# EAGLE schematic Lattepanda_shild_v1.3 (EAGLE 6.5.0)
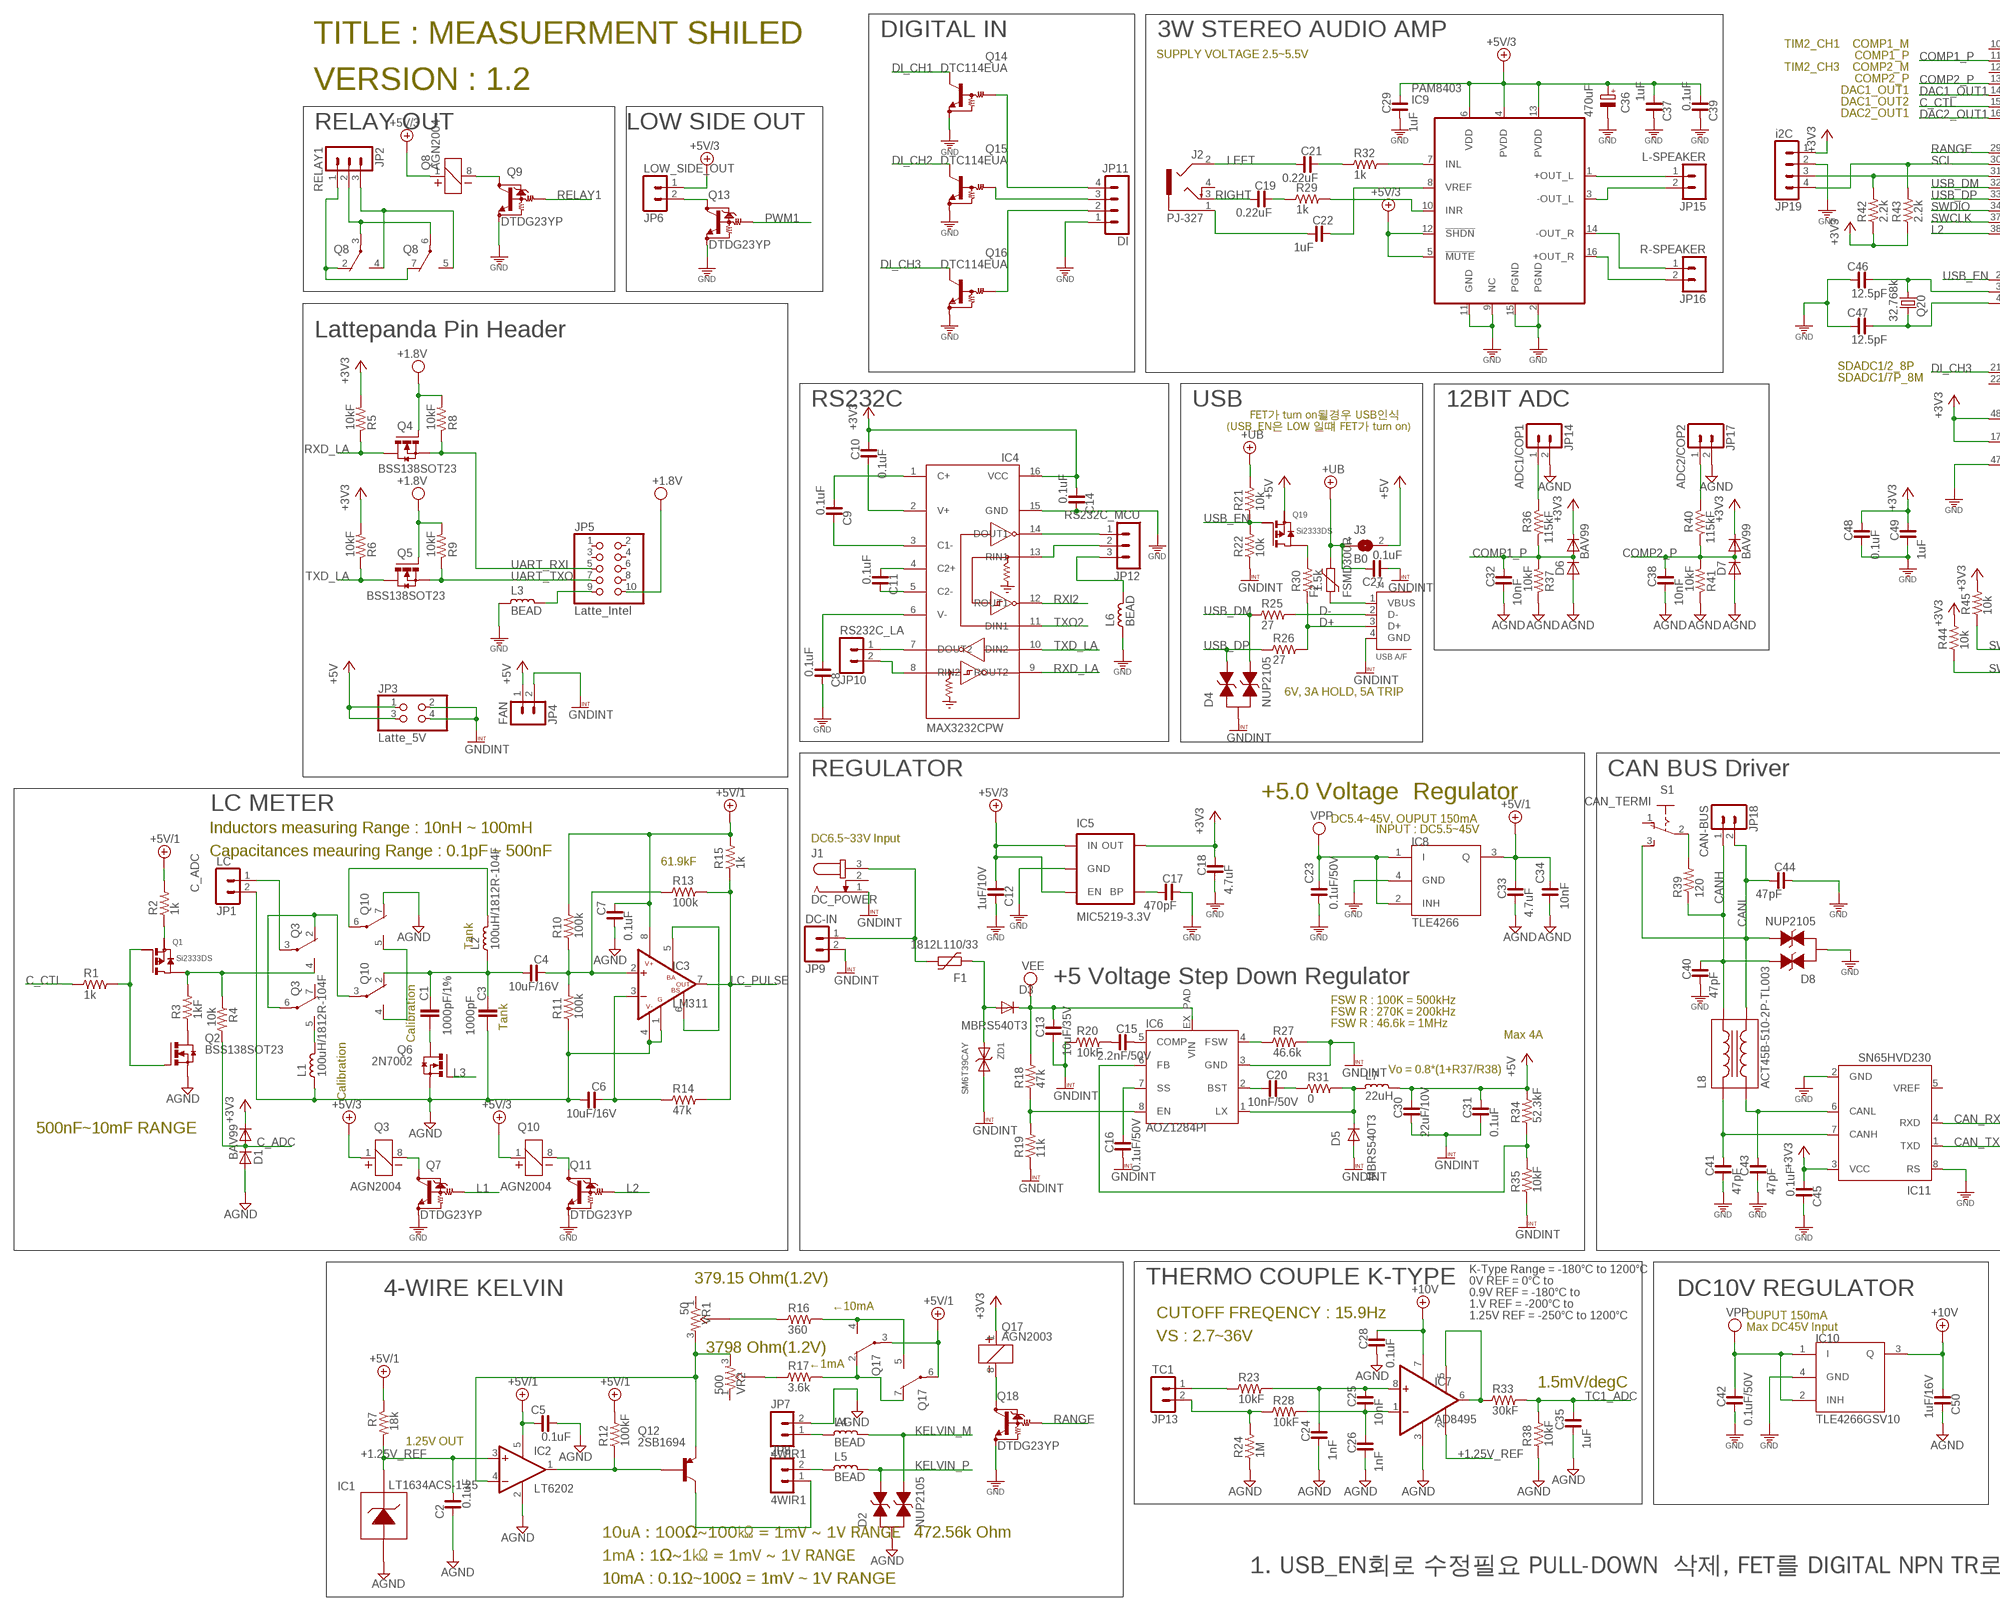
[diagram p0: schematic, sheet 1, part 1 of 2]
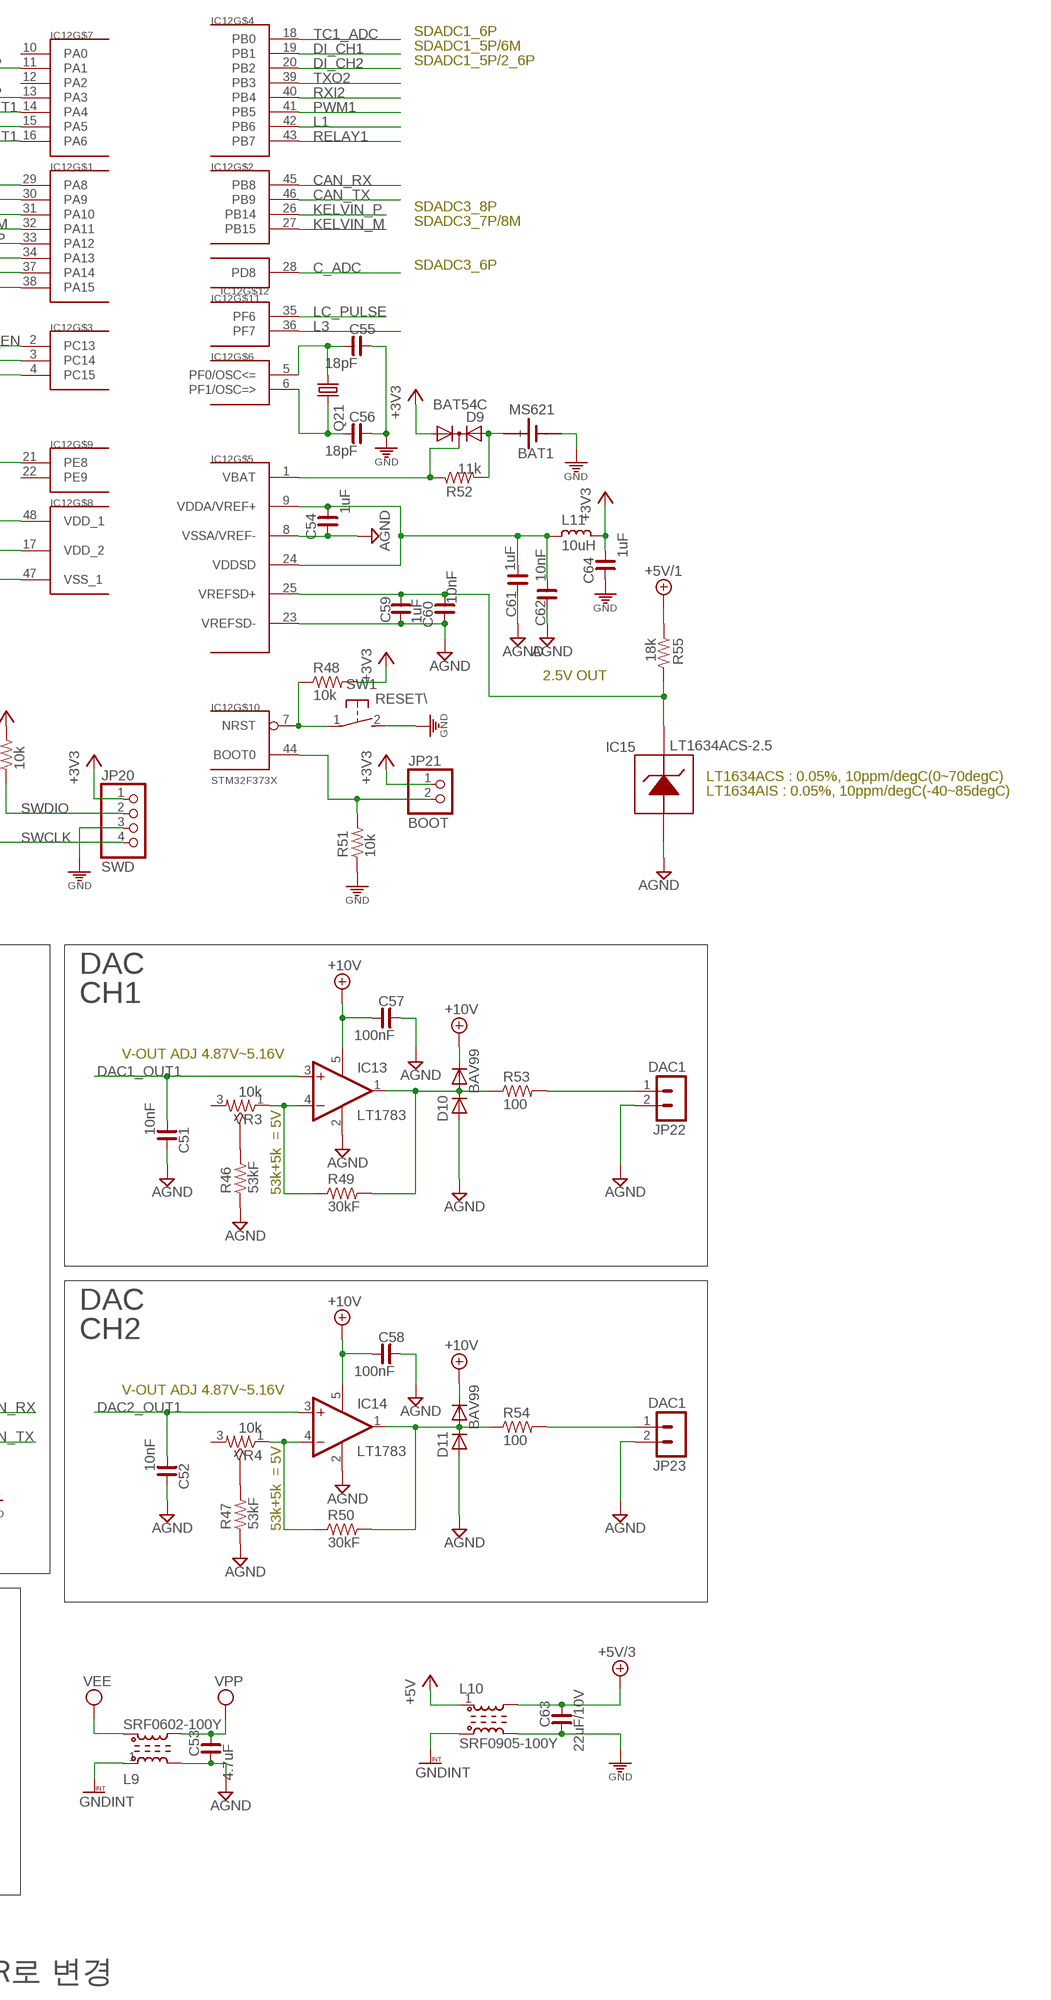
[diagram p1: schematic, sheet 1, part 2 of 2]

## Parts
BAT1  MS621  MS614  [MS621]
C1  1000pF/1%  C-EU050-025X075  [C050-025X075]
C2  0.1uF  C_0603  [C0603]
C3  1000pF  C-EU050-025X075  [C050-025X075]
C4  10uF/16V  C_3216  [C3216]
C5  0.1uF  C_0603  [C0603]
C6  10uF/16V  C_3216  [C3216]
C7  0.1uF  C_0603  [C0603]
C8  0.1uF  C_0603  [C0603]
C9  0.1uF  C_0603  [C0603]
C10  0.1uF  C_0603  [C0603]
C11  0.1uF  C_0603  [C0603]
C12  1uF/10V  C_0603  [C0603]
C13  10uF/35V  C_3225  [C3225]
C14  0.1uF  C_0603  [C0603]
C15  2.2nF/50V  C_0603  [C0603]
C16  0.1uF/50V  C_0603  [C0603]
C17  470pF  C_0603  [C0603]
C18  4.7uF  C_2012  [C2012]
C19  0.22uF  C_0603  [C0603]
C20  10nF/50V  C_0603  [C0603]
C21  0.22uF  C_0603  [C0603]
C22  1uF  C_0603  [C0603]
C23  0.1uF/50V  C_0603  [C1608-]
C24  1nF  C_0603  [C0603]
C25  10nF  C_0603  [C0603]
C26  1nF  C_0603  [C0603]
C27  0.1uF  C_0603  [C0603]
C28  0.1uF  C_0603  [C0603]
C29  1uF  C_0603  [C0603]
C30  22uF/10V  C_3216  [C3216]
C31  0.1uF  C_0603  [C0603]
C32  10nF  C_0603  [C0603]
C33  4.7uF  C_2012  [C2012]
C34  10nF  C_0603  [C1608-]
C35  1uF  C_0603  [C0603]
C36  470uF  CPOL-EUD/7343-31W  [D/7343-31W]
C37  1uF  C_0603  [C0603]
C38  10nF  C_0603  [C0603]
C39  0.1uF  C_0603  [C0603]
C40  47pF  C_0603  [C0603]
C41  47pF  C_0603  [C0603]
C42  0.1uF/50V  C_0603  [C0603]
C43  47pF  C_0603  [C0603]
C44  47pF  C_0603  [C0603]
C45  0.1uF  C_0603  [C0603]
C46  12.5pF  C_0603  [C0603]
C47  12.5pF  C_0603  [C0603]
C48  0.1uF  C_0603  [C0603]
C49  1uF  C_0603  [C0603]
C50  1uF/16V  C_0603  [C0603]
C51  10nF  C_0603  [C0603]
C52  10nF  C_0603  [C0603]
C53  4.7uF  C_2012  [C2012]
C54  1uF  C_0603  [C0603]
C55  18pF  C_0603  [C0603]
C56  18pF  C_0603  [C0603]
C57  100nF  C_0603  [C0603]
C58  100nF  C_0603  [C0603]
C59  1uF  C_0603  [C0603]
C60  10nF  C_0603  [C0603]
C61  1uF  C_0603  [C0603]
C62  10nF  C_0603  [C0603]
C63  22uF/10V  C_3216  [C3216]
C64  1uF  C_0603  [C0603]
D1  BAV99  [SOT23]
D2  NUP2105  NPU2105  [SOT23]
D3  MBRS540T3  DIODE-SMC  [SMC]
D4  NUP2105  NPU2105  [SOT23]
D5  MBRS540T3  DIODE-SMC  [SMC]
D6  BAV99  [SOT23]
D7  BAV99  [SOT23]
D8  NUP2105  NPU2105  [SOT23]
D9  BAT54C  [SOT23]
D10  BAV99  [SOT23]
D11  BAV99  [SOT23]
F1  1812L110/33  1812L  [1812L]
F2  FSMD300R  1812L  [1812L]
IC1  LT1634ACS-1.25  LT1634MS8  [MS8]
IC2  LT6202  TS507S  [SOT23-5L]
IC3  LM311  [SO8]
IC4  MAX3232CPW  MAX3232MAX232CPW  [PW_R-PDSO-G16]
IC5  MIC5219-3.3V  V_REG_LDOSMD  [SOT23-5]
IC6  AOZ1284PI  [S08-EP1]
IC7  AD8495  AD849X  [MSOP8]
IC8  TLE4266  TLE4266G  [SOT223-4]
IC9  PAM8403  [SOIC16N]
IC10  TLE4266GSV10  TLE4266G  [SOT223-4]
IC11  SN65HVD230  PCA82C250T  [SO8]
IC12  STM32F373X  [TQFP48]
IC13  LT1783  LT1783M5  [SOT23-5]
IC14  LT1783  LT1783M5  [SOT23-5]
IC15  LT1634ACS-2.5  LT1634MS8  [MS8]
J1  DC_POWER  JACK-PLUG0  [SPC4077]
J2  PJ-327  AUDIO_JACK2  [PJ-327-2]
J3  B0  SJ  [SJ]
J4  USB A/F  USB-AUSBA_SIDE  [USB_AF_SIDE]
JP1  LC  MA02ED350V-02P  [ED350V-02P]
JP2  RELAY1  MA03-1ESD350V-03P  [ED350V-03P]
JP3  Latte_5V  PINHD-2X2  [2X02]
JP4  FAN  MA02SMD  [MA02-1-MOL]
JP5  Latte_Intel  PINHD-2X5M  [2X05M]
JP6  LOW_SIDE_OUT  MA02ED350V-02P  [ED350V-02P]
JP7  4WIR1  MA02ED350V-02P  [ED350V-02P]
JP8  4WIR1  MA02ED350V-02P  [ED350V-02P]
JP9  DC-IN  MA02ED350V-02P  [ED350V-02P]
JP10  RS232C_LA  MA02ED350V-02P  [ED350V-02P]
JP11  DI  MA04-15267  [MOLEX5267-04]
JP12  RS232C_MCU  MA03-1ESD350V-03P  [ED350V-03P]
JP13  TC1  MA02ED350V-02P  [ED350V-02P]
JP14  ADC1/COP1  MA02ED350V-02P  [ED350V-02P]
JP15  L-SPEAKER  MA02ED350V-02P  [ED350V-02P]
JP16  R-SPEAKER  MA02ED350V-02P  [ED350V-02P]
JP17  ADC2/COP2  MA02ED350V-02P  [ED350V-02P]
JP18  CAN-BUS  MA02ED350V-02P  [ED350V-02P]
JP19  i2C  MA04-15267  [MOLEX5267-04]
JP20  SWD  PINHD-1X4M  [1X04M]
JP21  BOOT  PINHD-1X2M  [1X02M]
JP22  DAC1  MA02ED350V-02P  [ED350V-02P]
JP23  DAC1  MA02ED350V-02P  [ED350V-02P]
L1  100uH/1812R-104F  L_1210  [L1210]
L2  100uH/1812R-104F  L_1210  [L1210]
L3  BEAD  L_0603  [L0603]
L4  BEAD  L_0603  [L0603]
L5  BEAD  L_0603  [L0603]
L6  BEAD  L_0603  [L0603]
L7  22uH  L_SHP1260P-F  [SHP1260P-F]
L8  ACT45B-510-2P-TL003  CHOKE_COIL  [ACT45B]
L9  SRF0602-100Y  CM_COILSRF0602  [SRF0602]
L10  SRF0905-100Y  CM_COILSRF0905  [SRF0905]
L11  10uH  L_0805  [L0805]
Q1  Si2333DS  P-FET  [SOT23]
Q2  BSS138SOT23  [SOT23]
Q3  AGN2004  RELAY_CH2AGN200X  [ANG200X]
Q4  BSS138SOT23  [SOT23]
Q5  BSS138SOT23  [SOT23]
Q6  2N7002  BSS138SOT23  [SOT23]
Q7  DTDG23YP  [MPT3]
Q8  AGN2004  RELAY_CH2AGN200X  [ANG200X]
Q9  DTDG23YP  [MPT3]
Q10  AGN2004  RELAY_CH2AGN200X  [ANG200X]
Q11  DTDG23YP  [MPT3]
Q12  2SB1694  [SOT323]
Q13  DTDG23YP  [MPT3]
Q14  DTC114EUA  [SC59-BEC]
Q15  DTC114EUA  [SC59-BEC]
Q16  DTC114EUA  [SC59-BEC]
Q17  AGN2003  RELAY_CH2AGN200X  [ANG200X]
Q18  DTDG23YP  [MPT3]
Q19  Si2333DS  P-FET  [SOT23]
Q20  32.768k  MC-306  [MC-306]
Q21  8MHz  CRYSTALSMD5032  [SMD5032]
R1  1k  R_0603  [R0603]
R2  1k  R_0603  [R0603]
R3  1kF  R_0603  [R0603]
R4  10k  R_0603  [R0603]
R5  10kF  R_0603  [R0603]
R6  10kF  R_0603  [R0603]
R7  18k  R_0603  [R0603]
R8  10kF  R_0603  [R0603]
R9  10kF  R_0603  [R0603]
R10  100k  R_0603  [R0603]
R11  100k  R_0603  [R0603]
R12  100kF  R_0603  [R0603]
R13  100k  R_0603  [R0603]
R14  47k  R_0603  [R0603]
R15  1k  R_0603  [R0603]
R16  360  R_0603  [R0603]
R17  3.6k  R_0603  [R0603]
R18  47k  R_0603  [R0603]
R19  11k  R_0603  [R0603]
R20  10kF  R_0603  [R0603]
R21  10k  R_0603  [R0603]
R22  10k  R_0603  [R0603]
R23  10kF  R_0603  [R0603]
R24  1M  R_0603  [R0603]
R25  27  R_0603  [R0603]
R26  27  R_0603  [R0603]
R27  46.6k  R_0603  [R0603]
R28  10kF  R_0603  [R0603]
R29  1k  R_0603  [R0603]
R30  1.5k  R_0603  [R0603]
R31  0  R_0603  [R0603]
R32  1k  R_0603  [R0603]
R33  30kF  R_0603  [R0603]
R34  52.3kF  R_0603  [R0603]
R35  10kF  R_0603  [R0603]
R36  115kF  R_0603  [R0603]
R37  10kF  R_0603  [R0603]
R38  10kF  R_0603  [R0603]
R39  120  R-US_R1608  [R0603@1]
R40  115kF  R_0603  [R0603]
R41  10kF  R_0603  [R0603]
R42  2.2k  R_0603  [R0603]
R43  2.2k  R_0603  [R0603]
R44  10k  R_0603  [R0603]
R45  10k  R_0603  [R0603]
R46  53kF  R_0603  [R0603]
R47  53kF  R_0603  [R0603]
R48  10k  R_0603  [R0603]
R49  30kF  R_0603  [R0603]
R50  30kF  R_0603  [R0603]
R51  10k  R_0603  [R0603]
R52  11k  R_0603  [R0603]
R53  100  R_0603  [R0603]
R54  100  R_0603  [R0603]
R55  18k  R_0603  [R0603]
S1  CAN_TERMI  IMMS  [255SB]
SW1  RESET\  DTSM-3  [DTSM-3]
VR1  50  R-TRIMMER-SMD3313  [R-TRIMMER-3313J]
VR2  500  R-TRIMMER-SMD3313  [R-TRIMMER-3313J]
VR3  10k  R-TRIMMER-SMD3313  [R-TRIMMER-3313J]
VR4  10k  R-TRIMMER-SMD3313  [R-TRIMMER-3313J]
ZD1  SM6T39CAY  ZDSM6T33CAY  [SMB]

## Nets
+1.25V_REF: C2.2 IC1.6(VOUT) IC2.3(+IN) IC7.2(REF) R7.2
+3V3: C10.1 C14.2 C18.1 C45.2 C48.1 C49.1 C64.2 D1.S(C) D6.S(C) D7.S(C) D9.G IC4.16(VCC) IC5.5(OUT) IC11.3(VCC) IC12.17(VDD_2) IC12.48(VDD_1) JP19.1 JP20.1 JP21.1 L11.1 Q17.1 R5.2 R6.2 R42.1 R43.1 R44.2 R45.2 R48.2
+5V: C30.1 C31.1 J3.2 JP3.1 JP3.3 JP4.1 L7.1 L10.1 Q19.S(SOURCE) R34.2
+5V/1: C5.1 C7.1 C33.1 C34.2 IC2.5(V+) IC3.8(V+) IC8.3(Q) Q17.3(P) Q17.6(P) R2.2 R7.1 R10.2 R12.2 R15.2 R55.1
+5V/3: C12.2 C29.1 C36.+ C37.2 C39.2 C63.1 IC5.1(IN) IC5.3(EN) IC9.4(PVDD) IC9.5(!MUTE) IC9.6(VDD) IC9.12(!SHDN) IC9.13(PVDD) JP6.1 L10.2 Q3.1 Q8.1 Q10.1
+10V: C28.1 C50.2 C57.2 C58.2 D10.S(C) D11.S(C) IC7.7(V+) IC10.3(Q) IC13.5(V+) IC14.5(V+)
+UB: C27.1 F2.P$2 J3.1 R21.2
AGND: C2.1 C3.2 C5.2 C6.2 C7.2 C24.2 C26.2 C28.2 C32.2 C33.2 C34.1 C35.2 C38.2 C50.1 C51.1 C52.1 C53.2 C54.1 C57.1 C58.1 C59.2 C60.1 C61.1 C62.1 D1.G(A) D2.D(PIN3) D6.G(A) D7.G(A) D10.G(A) D11.G(A) IC1.4(GND) IC2.2(V-) IC3.1(G) IC3.4(V-) IC7.3(V-) IC12.8(VSSA/VREF-) IC12.23(VREFSD-) IC13.2(V-) IC14.2(V-) IC15.4(GND) JP1.2 JP7.2 JP14.2 JP17.2 JP22.2 JP23.2 L1.2 L9.2 Q2.S Q6.S Q10.7(O) R11.1 R24.1 R37.1 R38.1 R41.1 R46.1 R47.1
BOOT1: IC12.44(BOOT0) JP21.2 R51.2
C_ADC: D1.D(AC) IC12.28(PD8) R4.2
C_CTL: IC12.15(PA5) R1.1
CAN_RX: IC11.4(RXD) IC12.45(PB8)
CAN_TX: IC11.1(TXD) IC12.46(PB9)
CANH: C40.1 D8.G(PIN1) JP18.1 L8.4 R39.1
CANL: C44.2 D8.S(PIN2) JP18.2 L8.3 S1.3(S)
COMP1_P: C32.1 D6.D(AC) IC12.11(PA1) R36.2 R37.2
COMP2_P: C38.1 D7.D(AC) IC12.13(PA3) R40.2 R41.2
D+: J4.3(D+) R26.2 R30.1
D-: J4.2(D-) R25.2
DAC1_OUT1: C51.2 IC12.14(PA4) IC13.3(+IN)
DAC2_OUT1: C52.2 IC12.16(PA6) IC14.3(+IN)
DC-IN: D3.A F1.P$1 ZD1.A
DI_CH1: IC12.19(PB1) Q14.3(OUT)
DI_CH2: IC12.20(PB2) Q15.3(OUT)
DI_CH3: IC12.21(PE8) Q16.3(OUT)
GND [GND]: BAT1.- C8.1 C12.1 C14.1 C17.1 C18.2 C23.1 C29.2 C36.- C37.1 C39.1 C40.2 C41.2 C42.2 C43.2 C44.1 C45.1 C46.1 C47.1 C48.2 C49.2 C55.1 C56.1 C63.2 C64.1 D8.D(PIN3) IC4.15(GND) IC5.2(GND) IC8.4(GND) IC9.2(PGND) IC9.9(NC) IC9.11(GND) IC9.15(PGND) IC10.4(GND) IC11.2(GND) IC11.8(RS) IC12.47(VSS_1) JP11.1 JP19.2 JP20.3 L3.2 L6.2 L10.3 Q7.EMITTER(GND) Q9.EMITTER(GND) Q11.EMITTER(GND) Q13.EMITTER(GND) Q14.1(GND) Q15.1(GND) Q16.1(GND) Q18.EMITTER(GND) R51.1 SW1.2
GNDINT [GND]: C13.2 C16.2 C27.2 C30.2 C31.2 D4.D(PIN3) D5.A IC6.3(GND) J1.1 J4.4(GND) JP3.2 JP3.4 JP4.2 JP9.2 L9.1 L10.4 R19.1 R20.1 R22.1 R27.2 R35.1 ZD1.C(K)
KELVIN_M: D2.S(PIN2) IC12.27(PB15) L4.1
KELVIN_P: D2.G(PIN1) IC12.26(PB14) L5.1
L1: IC12.42(PB6) Q7.BASE(IN)
L2: IC12.38(PA15) Q11.BASE(IN)
L3: IC12.36(PF7) Q6.G
LC_PULSE: IC3.7(OUT) IC12.35(PF6) R13.2 R14.2 R15.1
LEFT: C21.2 J2.2
N$1 [GND]: JP6.2 Q13.COLLECTOR(OUT)
N$2 [GND]: JP12.3 L6.1
N$3: IC6.6(FB) R34.1 R35.2
N$4: C20.2 IC6.2(BST)
N$5: C43.1 IC11.6(CANL) L8.2
N$6: C41.1 IC11.7(CANH) L8.1
N$7: R17.1 VR2.2
N$8: C20.1 R31.1
N$9: D5.C IC6.1(LX) L7.2 R31.2
N$10: C15.1 IC6.5(COMP)
N$11: C15.2 R20.2
N$12: R39.2 S1.2(P)
N$13: R47.2 VR4.2
N$14: C11.1 IC4.5(C2-)
N$15: C11.2 IC4.4(C2+)
N$16: C10.2 IC4.2(V+)
N$17: IC14.4(-IN) R50.1 VR4.1
N$18: D11.D(AC) IC14.1(OUT) R50.2 R54.1
N$19: IC6.8(EN) R18.1 R19.2
N$20: JP7.1 L4.2
N$21: IC6.4(FSW) R27.1
N$22: JP8.2 L5.2
N$24: C16.1 IC6.7(SS)
N$25: D9.D IC12.1(VBAT) R52.1
N$26: C8.2 IC4.6(V-)
N$27: C9.2 IC4.1(C+)
N$28: IC4.8(RIN2) JP10.2
N$29: C9.1 IC4.3(C1-)
N$30: IC2.1(OUT) Q12.2(B) R12.1
N$31: Q8.8 Q9.COLLECTOR(OUT)
N$32: IC4.7(DOUT2) JP10.1
N$33 [GND]: JP5.9 L3.1
N$34: IC12.7(NRST) R48.1 SW1.1
N$35: C56.2 IC12.6(PF1/OSC=>) Q21.3
N$36: IC4.13(RIN1) JP12.2
N$37: IC3.5(BA) IC3.6(BS)
N$38: C54.2 C61.2 C62.2 IC12.9(VDDA/VREF+) IC12.24(VDDSD) L11.2
N$39: C6.1 IC3.3(-IN) R14.1
N$40: IC4.14(DOUT1) JP12.1
N$41: C25.2 C26.1 IC7.1(-IN) R28.2
N$42: C24.1 C25.1 IC7.8(+IN) R23.2
N$43: IC9.7(INL) R32.2
N$44: IC9.1(+OUT_L) JP15.1
N$45: JP13.2 R24.2 R28.1
N$46: JP13.1 R23.1
N$47: IC7.5(SENS) IC7.6(OUT) R33.1
N$48: C4.1 IC3.2(+IN) R10.1 R11.2 R13.1
N$49: JP8.1 Q12.3(C)
N$50: JP14.1 R36.1
N$51: JP17.1 R40.1
N$52: IC9.3(-OUT_L) JP15.2
N$53: IC9.14(-OUT_R) JP16.1
N$54: IC9.16(+OUT_R) JP16.2
N$55: IC9.10(INR) R29.2
N$56: C22.1 IC9.8(VREF)
N$57: C22.2 J2.1
N$58: C21.1 R32.1
N$59: F2.P$1 J4.1(VBUS)
N$60: JP22.1 R53.2
N$61: Q1.S(SOURCE) R2.1
N$62: C17.2 IC5.4(BP)
N$63: Q2.D R3.1
N$64: R16.1 VR1.2
N$65: C19.1 R29.1
N$66: Q17.8 Q18.COLLECTOR(OUT)
N$67: Q17.4(S) Q17.5(S) R16.2
N$68: C59.1 C60.2 IC12.25(VREFSD+) IC15.6(VOUT) R55.2
N$69: L1.1 Q3.5(S)
N$70: IC2.4(-IN) Q12.1(E) VR1.3 VR2.3
N$71: IC13.4(-IN) R49.1 VR3.1
N$72: Q17.2(O) Q17.7(O) R17.2
N$73: Q10.4(S) Q10.5(S)
N$74: C1.1 C3.1 C4.2 L2.2 Q10.2(O)
N$75: Q1.G(GATE) Q2.G R1.2
N$76: Q10.8 Q11.COLLECTOR(OUT)
N$77: Q3.2(O) Q3.6(P) Q10.3(P)
N$78: C1.2 Q6.D
N$79: L2.1 Q10.6(P)
N$80: Q3.8 Q7.COLLECTOR(OUT)
N$81: Q19.D(DRAIN) R30.2
N$82: Q1.D(DRAIN) Q3.4(S) R3.2 R4.1
N$83: JP1.1 Q3.3(P)
N$84: D10.D(AC) IC13.1(OUT) R49.2 R53.1
N$85: R46.2 VR3.2
N$86: JP2.2 Q8.3(P) Q8.6(P)
N$87: C55.2 IC12.5(PF0/OSC<=) Q21.1
N$88: JP2.1 Q8.2(O) Q8.7(O)
N$89: JP2.3 Q8.4(S) Q8.5(S)
N$90: JP23.1 R54.2
N$91: IC12.31(PA10) JP19.3 R42.2
N$92: BAT1.+ D9.S R52.2
N$93: JP11.2 Q16.2(IN)
N$94: JP11.3 Q15.2(IN)
N$95: C46.2 IC12.3(PC14) Q20.1
N$96: C47.2 IC12.4(PC15) Q20.4
N$97: JP11.4 Q14.2(IN)
N$99: F1.P$2 J1.3 JP9.1
PWM1: IC12.41(PB5) Q13.BASE(IN)
RANGE: IC12.29(PA8) Q18.BASE(IN)
RELAY1: IC12.43(PB7) Q9.BASE(IN)
RIGHT: C19.2 J2.3
RXD_LA: IC4.9(ROUT2) Q4.D R5.1
RXI2: IC4.12(ROUT1) IC12.40(PB4)
SCL: IC12.30(PA9) JP19.4 R43.2
SWCLK: IC12.37(PA14) JP20.4 R44.1
SWDIO: IC12.34(PA13) JP20.2 R45.1
TC1_ADC: C35.1 IC12.18(PB0) R33.2 R38.2
TXD_LA: IC4.10(DIN2) Q5.D R6.1
TXO2: IC4.11(DIN1) IC12.39(PB3)
UART_RXI: JP5.5 Q4.S R8.1
UART_TXO: JP5.7 Q5.S R9.1
USB_DM: D4.S(PIN2) IC12.32(PA11) R25.1
USB_DP: D4.G(PIN1) IC12.33(PA12) R26.1
USB_EN: IC12.2(PC13) Q19.G(GATE) R21.1 R22.2
VDD: JP5.10 Q4.G Q5.G R8.2 R9.2 ; supply symbol labelled +1.8V
VEE: C13.1 D3.C IC6.EX_PAD(VIN) L9.4 R18.2
VPP: C23.2 C42.1 C53.1 IC8.1(I) IC8.2(INH) IC10.1(I) IC10.2(INH) L9.3
Unconnected: IC11.5(VREF) IC12.10(PA0) IC12.12(PA2) IC12.22(PE9) J1.2 J2.4 JP5.1 JP5.2 JP5.3 JP5.4 JP5.6 JP5.8 Q3.7(O) S1.1(O) VR1.1 VR2.1 VR3.3 VR4.3

## Notes on the sheet
- SDADC1_6P
- TITLE : MEASUERMENT SHILED | DIGITAL IN | 3W STEREO AUDIO AMP | SDADC1_5P/6M
- SUPPLY VOLTAGE 2.5~5.5V | TIM2_CH1 | COMP1_M | SDADC1_5P/2_6P
- COMP1_P
- TIM2_CH3 | COMP2_M
- COMP2_P
- VERSION : 1.2
- DAC1_OUT1
- DAC1_OUT2
- DAC2_OUT1
- RELAY OUT | LOW SIDE OUT
- SDADC3_8P
- SDADC3_7P/8M
- SDADC3_6P
- Lattepanda Pin Header
- SDADC1/2_8P
- SDADC1/7P_8M
- RS232C | USB | 12BIT ADC
- FET가 turn on될경우 USB인식
- (USB_EN은 LOW 일떄 FET가 turn on)
- 2.5V OUT
- LT1634ACS : 0.05%, 10ppm/degC(0~70degC)
- LT1634AIS : 0.05%, 10ppm/degC(-40~85degC)
- 6V, 3A HOLD, 5A TRIP
- REGULATOR | CAN BUS Driver | DAC
- +5.0 Voltage  Regulator | CH1
- LC METER
- DC5.4~45V, OUPUT 150mA
- Inductors measuring Range : 10nH ~ 100mH | DC6.5~33V Input | INPUT : DC5.5~45V | V-OUT ADJ 4.87V~5.16V
- Capacitances meauring Range : 0.1pF ~ 500nF | 61.9kF
- Tank | 53k+5k  = 5V
- +5 Voltage Step Down Regulator
- FSW R : 100K = 500kHz
- FSW R : 270K = 200kHz
- FSW R : 46.6k = 1MHz
- Tank | Max 4A
- Calibration | DAC
- Vo = 0.8*(1+R37/R38) | CH2
- Calibration | V-OUT ADJ 4.87V~5.16V
- 500nF~10mF RANGE
- 53k+5k  = 5V
- K-Type Range = -180°C to 1200°C
- 379.15 Ohm(1.2V) | THERMO COUPLE K-TYPE | 0V REF = 0°C to
- 4-WIRE KELVIN | 0.9V REF = -180°C to | DC10V REGULATOR
- ←10mA | 1.V REF = -200°C to
- CUTOFF FREQENCY : 15.9Hz | 1.25V REF = -250°C to 1200°C | OUPUT 150mA
- Max DC45V Input
- VS : 2.7~36V
- 3798 Ohm(1.2V)
- ←1mA
- 1.5mV/degC
- 1.25V OUT
- 10uA : 100Ω~100㏀ = 1mV ~ 1V RANGE | 472.56k Ohm
- 1mA : 1Ω~1㏀ = 1mV ~ 1V RANGE
- 1. USB_EN회로 수정필요 PULL-DOWN  삭제, FET를 DIGITAL NPN TR로 변경
- 10mA : 0.1Ω~100Ω = 1mV ~ 1V RANGE

## Library data of the parts
BAT1 = cona_lib:MS614: SII Micro Battery
C1 C3 = rcl:C-EU: CAPACITOR, European symbol
C2 C4-C22 C24-C33 C35 C37-C64 = cona_lib:C_: NON-POLARIZED CAP
C23 C34 = GRU-EURO6:C_: NON-POLARIZED CAP
C36 = cona_lib:CPOL-EU: POLARIZED CAPACITOR, European symbol
D1 D6 D7 D10 D11 = cona_lib:BAV99
D2 D4 D8 = cona_lib:NPU2105
D3 D5 = diode:DIODE-: DIODE
D9 = cona_lib:BAT54C
F1 F2 = ptc-littlefuse:1812L
IC1 IC15 = cona_lib:LT1634: Initial Voltage Accuracy: 0.05% n Low Operating Current: 10µA n Low Drift: 10ppm/°C Max n Less Than 1Ω Dynamic Impedance n Both Commercial and Industrial Temperature Range Parts Are Available n Available in 1.25V, 2.5V, 4.096V and 5V in SO-8 and TO-92 Packages n 1.25V and 2.5V Available in MSOP Package
IC2 = cona_lib:TS507: High precision rail-to-rail operational amplifier Ultra low offset voltage: 25 µV typ, 100 µV max
IC3 = cona_lib:LM311
IC4 = cona_lib:MAX3232: TI
IC5 = SparkFun:V_REG_LDO: Voltage Regulator LDO Standard 150mA LDO voltage regulator in SOT-23 layout. Micrel part MIC5205. BP (by-pass) pin is used to lower output noise with 470pF cap.
IC6 = cona_lib:AOZ1284PI
IC7 = cona_lib:AD849X
IC8 IC10 = GRU-EURO6:TLE4266G
IC9 = cona_lib:PAM8403
IC11 = cona_lib:PCA82C250: CAN CONTROLLER INTERFACE
IC12 = stm32:STM32F373X
IC13 IC14 = GRU-EURO6:LT1783: General Purpose, Low Voltage, Rail-to-Rail Output Operational Amplifiers Source: http://www.national.com/mpf/LM/LMV321.html http://www.national.com/dt/lmv_qual.pdf
J1 = con-jack:JACK-PLUG: DC POWER JACK Power Jack, DC, Right Angle, Through Hole, Rated 5A at 16VDC, PC Terminals Distributor: Farnell (www.Farnell.de) Drawing: 84N1161.pdf / 84N1162.pdf Manufacturer: SPC Technology (www.spctechnology.com) Type: SPC4077 / SPC 4078
J2 = cona_lib:AUDIO_JACK2
J3 = cona_lib:SJ: SMD solder JUMPER
J4 = cona_lib:USB-A: USB A NTOM20014
JP1 JP4 JP6-JP10 JP13-JP18 JP22 JP23 = cona_lib:MA02
JP2 JP12 = cona_lib:MA03-1: PIN HEADER
JP3 = pinhead:PINHD-2X2: PIN HEADER
JP5 = pinhead:PINHD-2X5: PIN HEADER
JP11 JP19 = cona_lib:MA04-1: PIN HEADER
JP20 = pinhead:PINHD-1X4: PIN HEADER
JP21 = pinhead:PINHD-1X2: PIN HEADER
L1-L7 L11 = cona_lib:L_: INDUCTOR
L8 = cona_lib:CHOKE_COIL
L9 L10 = cona_lib:CM_COIL
Q1 Q19 = cona_lib:P-FET
Q2 Q4-Q6 = cona_lib:BSS138: N-Channel Logic Level Enhancement Mode Field Effect Transistor
Q3 Q8 Q10 Q17 = cona_lib:RELAY_CH2
Q7 Q9 Q11 Q13 Q18 = cona_lib:DTDG23YP
Q12 = cona_lib:2SB1694
Q14-Q16 = cona_lib:DTC114EUA: NPN Bias Resistor Transistor
Q20 = crystal:MC-306: kHz RANGE CRYSTAL UNIT SMD Source: MC-306_405_406_E07X.PDF Homepage <http://www.epsontoyocom.co.jp>; MPN: MC-306 60.0KHZ 100PPM ,12.5PF; OC_FARNELL: 1278040; OC_NEWARK: 31M5576
Q21 = cona_lib:CRYSTAL: CRYSTAL
R1-R38 R40-R55 = cona_lib:R_: RESISTOR
R39 = cona_lib:R-US_: RESISTOR, American symbol
S1 = cona_lib:IMMS: SLIDING SWITCH Distributor Buerklin, 11G810
SW1 = switch-tact:DTSM-3
VR1-VR4 = cona_lib:R-TRIMMER-SMD: SMD R-TRIMMER
ZD1 = GRU-EURO6:ZD

## Net classes
0 default: width 0.178 mm, drill 0.3 mm, clearance 0.178 mm
1 power: width 0.152 mm
2 GND: width 0.152 mm, clearance 0.152 mm